# EasyEDA Pro project Type_C硬盘盒_2025-09-27_14-32-02.eprj, schematic Schematic1_1
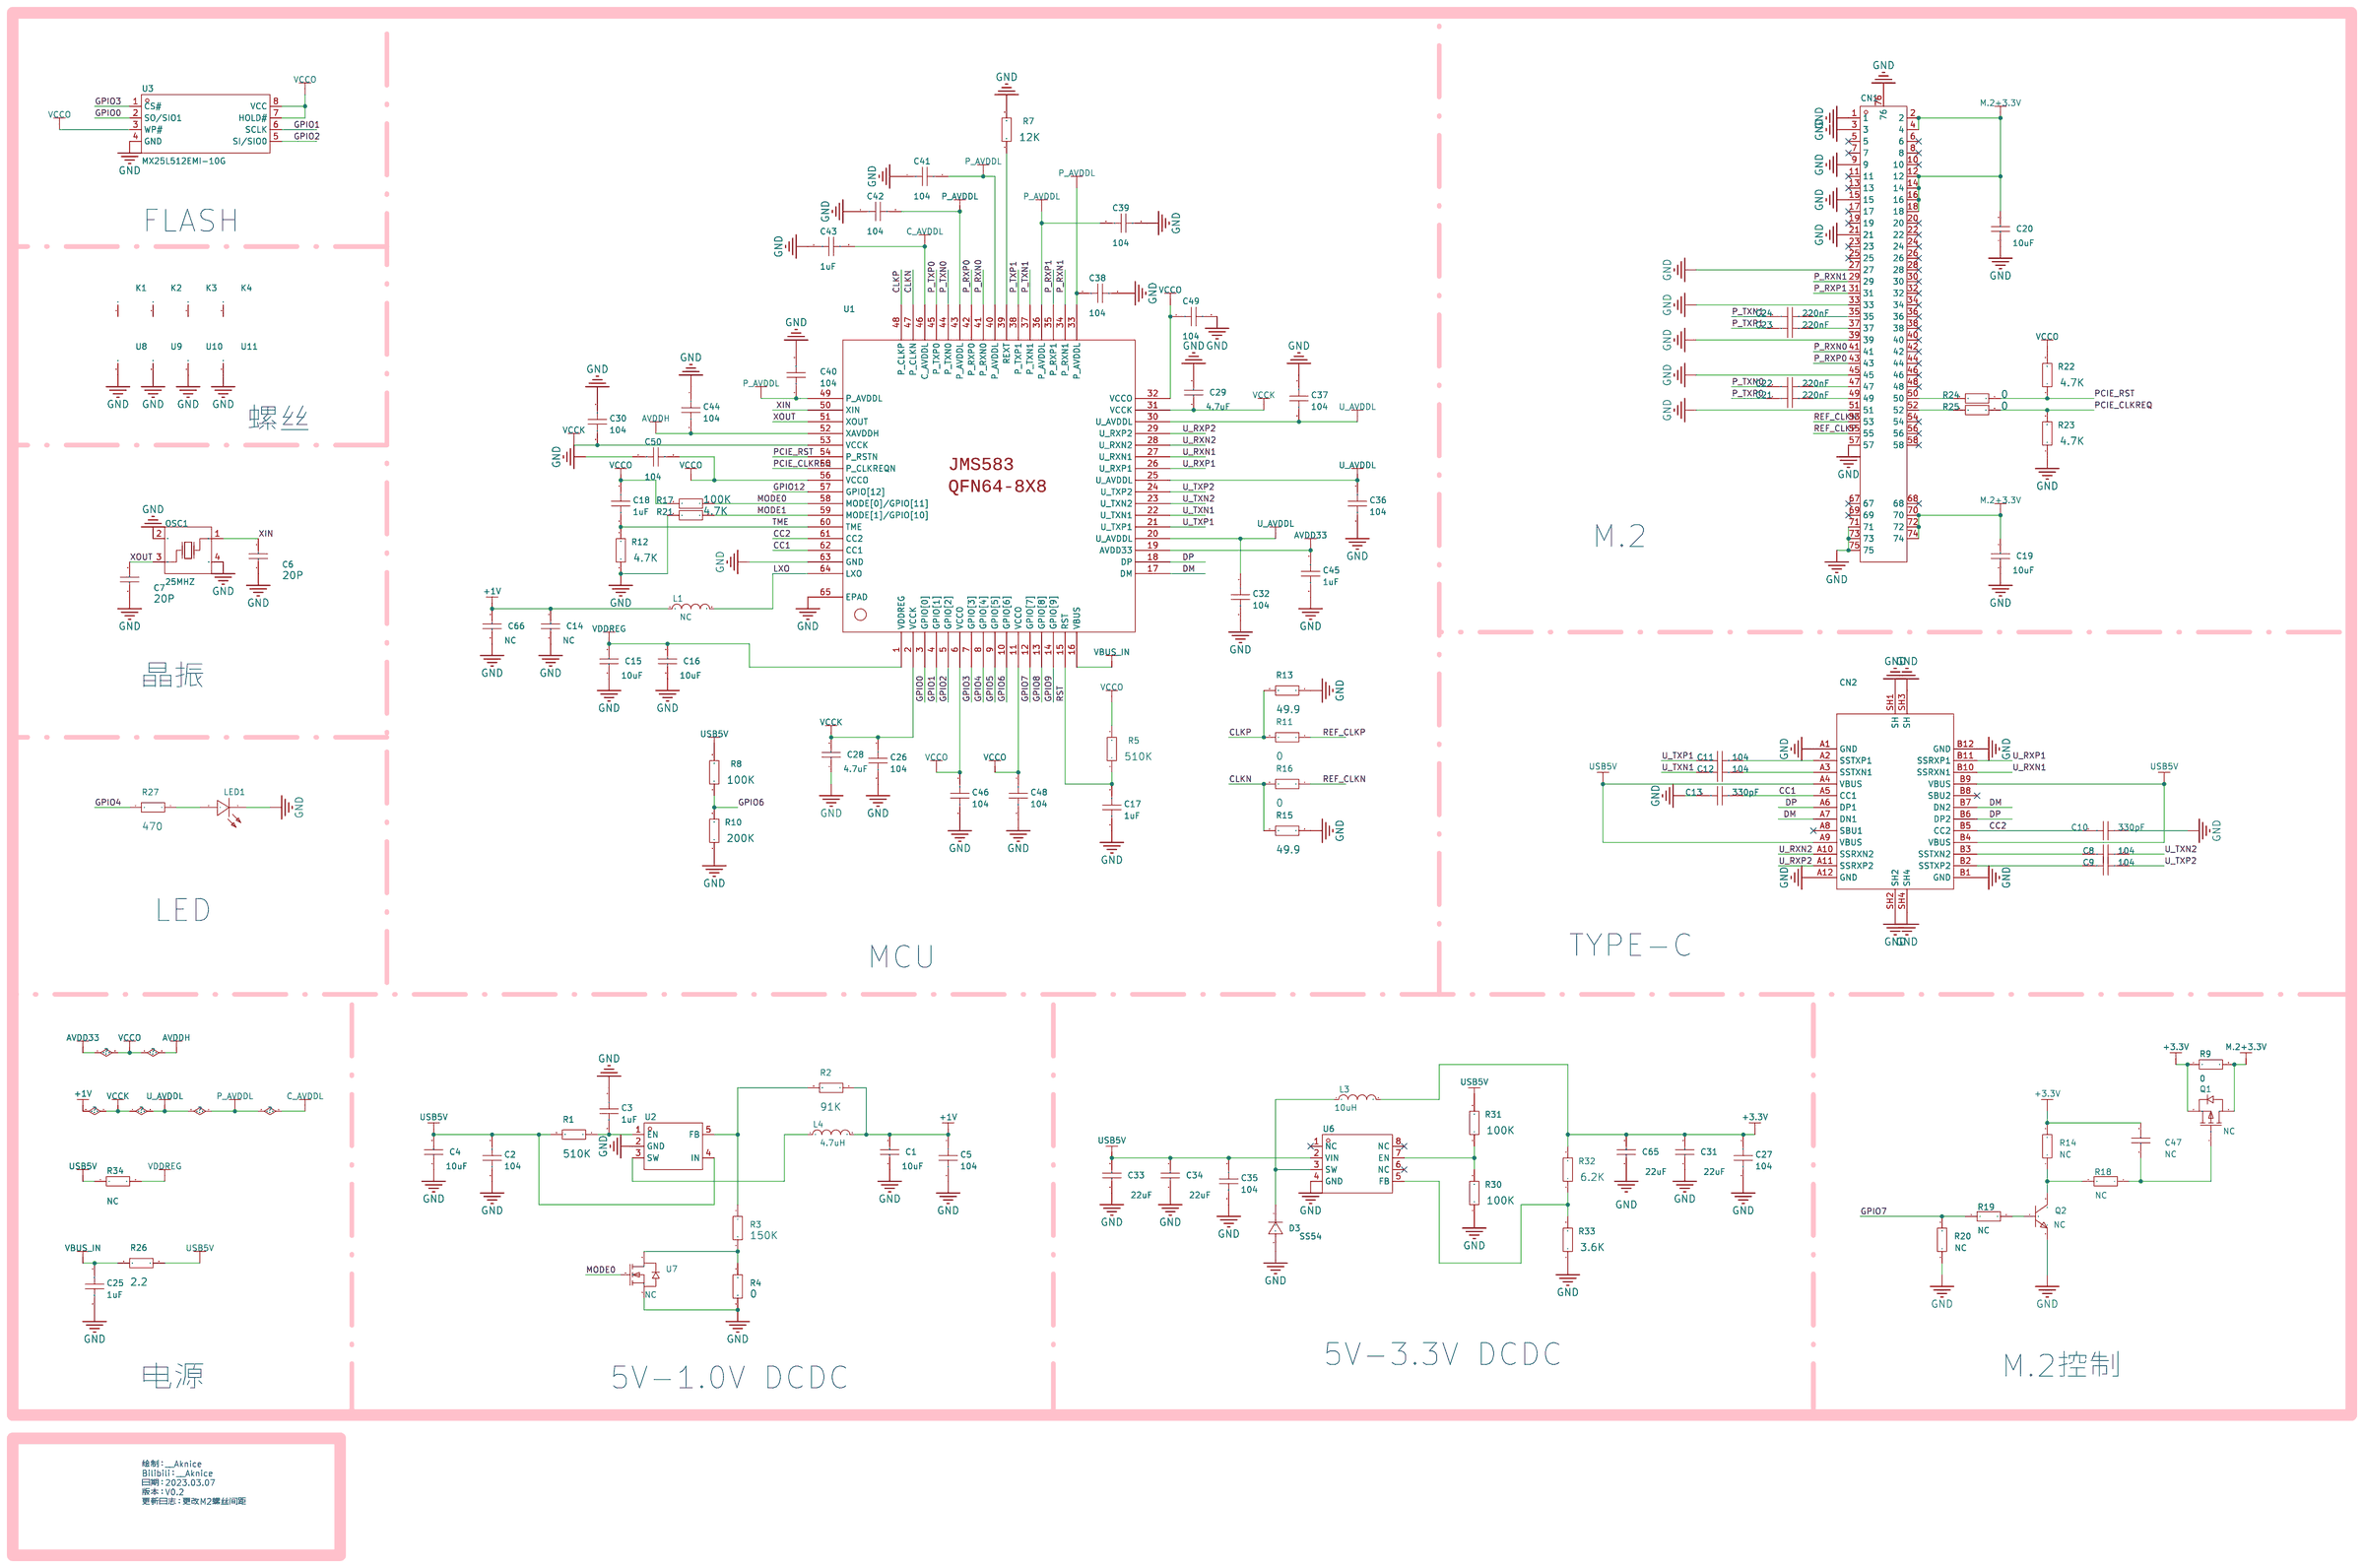
[diagram p1: schematic sheet]

## Parts
C1  100nF  [C0805]
C2  104  [C0603]
C3  1uF  [C0603]
C4  100nF  [C0805]
C5  104  [C0603]
C6  33pF  [C0603]
C7  33pF  [C0603]
C8  104  [C0603]
C9  104  [C0603]
C10  330pF  [C0603]
C11  104  [C0603]
C12  104  [C0603]
C13  330pF  [C0603]
C14  100nF  [C0805]
C15  100nF  [C0805]
C16  100nF  [C0805]
C17  1uF  [C0603]
C18  1uF  [C0603]
C19  100nF  [C0805]
C20  100nF  [C0805]
C21  220nF  [C0603]
C22  220nF  [C0603]
C23  220nF  [C0603]
C24  220nF  [C0603]
C25  1uF  [C0603]
C26  104  [C0603]
C27  104  [C0603]
C28  100nF  [C0805]
C29  100nF  [C0805]
C30  104  [C0603]
C31  100uF  [C1206]
C32  104  [C0603]
C33  100uF  [C1206]
C34  100uF  [C1206]
C35  104  [C0603]
C36  104  [C0603]
C37  104  [C0603]
C38  104  [C0603]
C39  104  [C0603]
C40  104  [C0603]
C41  104  [C0603]
C42  104  [C0603]
C43  1uF  [C0603]
C44  104  [C0603]
C45  1uF  [C0603]
C46  104  [C0603]
C47  NC  [C0805]
C48  104  [C0603]
C49  104  [C0603]
C50  104  [C0603]
C65  100uF  [C1206]
C66  100nF  [C0805]
CN1  91302-32-067RDM  [CONN-SMD_91302-32-067RDM]
CN2  USB-307HE-B-SU  [USB-TYPE-C-SMD_USB-307HE-B-SU]
D3  SS54  [SMA_L4.3-W2.7-LS5.1-RD]
K1  -  [M3无外边]
K2  -  [M3无外边]
K3  -  [M3无外边]
K4  -  [M3无外边]
L1  4.7uH  [IND-SMD_L4.5-W4.0-1]
L3  1uH  [IND-SMD_L7.3-W6.6]
L4  4.7uH  [IND-SMD_L4.5-W4.0-1]
LED1  led0805  [LED0805-RD]
OSC1  25MHZ  [OSC-SMD_4P-L3.2-W2.5-BL]
Q1  NC  [SOT-23-3_L2.9-W1.3-P1.90-LS2.4-BR]
Q2  NC  [SOT-23-3_L2.9-W1.3-P1.90-LS2.4-BR]
R1  510K  [R0603]
R2  510K  [R0603]
R3  510K  [R0603]
R4  510K  [R0603]
R5  510K  [R0603]
R7  510K  [R0603]
R8  510K  [R0603]
R9  0  [R1206]
R10  510K  [R0603]
R11  510K  [R0603]
R12  510K  [R0603]
R13  510K  [R0603]
R14  NC  [R0603]
R15  510K  [R0603]
R16  510K  [R0603]
R17  510K  [R0603]
R18  NC  [R0603]
R19  NC  [R0603]
R20  NC  [R0603]
R21  510K  [R0603]
R22  510K  [R0603]
R23  510K  [R0603]
R24  510K  [R0603]
R25  510K  [R0603]
R26  510K  [R0603]
R27  510K  [R0603]
R30  100K  [R0603]
R31  100K  [R0603]
R32  6.2K  [R0603]
R33  3.6K  [R0603]
R34  NC  [R1206]
U1  JMS583  [QFN-64_L8.0-W8.0-P0.40-TL-EP6.0]
U2  RY3430  [TSOT-23-5_L2.9-W1.6-P0.95-LS2.8-BR]
U3  MX25L512EMI-10G  [SOP-8_L4.9-W3.9-P1.27-LS6.0-BL]
U6  TD1583  [SOP-8_L5.0-W4.0-P1.27-LS6.0-BL]
U7  NC  [SOT-23-3_L2.9-W1.3-P0.95-LS2.4-BR]
U8  -  [M3]
U9  -  [M3]
U10  -  [M3]
U11  -  [M3]

## Library data of the parts
C1 C4 C14-C16 C19 C20 C28 C29 C47 C66 = CC0805KRX7R9BB104: 容值:100nF;精度:±10%;额定电压:50V;材质(温度系数):X7R;; LCSC Part Name: 100nF ±10% 50V; Supplier Part: C49678; Manufacturer: YAGEO(国巨); Supplier Footprint: 0805; JLCPCB Part Class: 基础库; Datasheet: https://atta.szlcsc.com/upload/public/pdf/source/20151026/1457707504898.pdf; Supplier: LCSC; Tolerance: ±10%; Voltage Rated: 50V; Temperature Coefficient: X7R
C2 C3 C5 C8-C13 C17 C18 C21-C27 C30 C32 C35-C46 C48-C50 = CC0603KRX7R8BB474: 精度:±10%;容值:470nF;额定电压:25V;温漂系数（介质材料):X7R;; LCSC Part Name: 470nF(474) ±10% 25V; Supplier Part: C106854; Supplier Footprint: 0603; JLCPCB Part Class: 扩展库; Datasheet: https://atta.szlcsc.com/upload/public/pdf/source/20190902/C106854_B621F3F82DC7FB7708A2F9CEE6ED7E21.pdf; Supplier: LCSC
C6 C7 = CC0603JRNPO9BN270: 容值:27pF;精度:±5%;额定电压:50V;材质(温度系数):NP0;; LCSC Part Name: 27pF ±5% 50V; Supplier Part: C107045; Manufacturer: YAGEO(国巨); Supplier Footprint: 0603; JLCPCB Part Class: 基础库; Datasheet: https://atta.szlcsc.com/upload/public/pdf/source/20170420/1492670692625.pdf; Supplier: LCSC; Tolerance: ±5%; Voltage Rated: 50V; Temperature Coefficient: NP0
C31 C33 C34 C65 = C1206-100u: 容值:100uF;精度:±20%;额定电压:6.3V;温度系数:X5R;; LCSC Part Name: 100uF ±20% 6.3V; Supplier Part: C15008; Manufacturer: SAMSUNG(三星); Manufacturer Part: CL31A107MQHNNNE; Supplier Footprint: 1206; JLCPCB Part Class: 基础库; Datasheet: https://atta.szlcsc.com/upload/public/pdf/source/20160103/1457707673200.pdf; Supplier: LCSC; Tolerance: ±20%; Voltage Rated: 6.3V; Temperature Coefficient: X5R
CN1 = 91302-32-067RDM: 连接器类型:M.2;间距:0.5mm;引脚总数:67;安装方式:卧贴;工作温度范围:-;; LCSC Part Name: M.2 0.5mm P数:67; Supplier Part: C1509730; Manufacturer: UMaxconn; Supplier Footprint: SMD,P=0.5mm; JLCPCB Part Class: 扩展库; Datasheet: https://atta.szlcsc.com/upload/public/pdf/source/20201222/C1509730_AC90C0C57A92915C4400196DE1999DDA.pdf; Supplier: LCSC; Connector Type: M.2; Pitch: 0.5mm; Number of Pins: 67; Mounting Style: 卧贴; Height Above Board: 3.2mm
CN2 = USB-307HE-B-SU: 连接器类型:Type-C;标准:-;公母:母座;触点数量:24;端口数量:1;安装方式:夹板;额定电流 - 电源:3A;工作温度范围:-;; LCSC Part Name: USB 3.1 C TYPE夹板式0.8 CONN.; Supplier Part: C309351; Manufacturer: HOOYA(香港皓宇); Datasheet: https://atta.szlcsc.com/upload/public/pdf/source/20181226/C309351_EE1D2376221C0442560ED3DEEBB52665.pdf; Supplier: LCSC; Connector Type: Type-C; Gender: 母座; Number of Contacts: 24; Number of Ports: 1; Mounting Style: 夹板; Current Rating - Power (Max): 3A
D3 = SS54_C908681: 二极管配置:独立式;直流反向耐压(Vr):40V;平均整流电流(Io):5A;正向压降(Vf):550mV@5A;反向电流(Ir):200uA@40V;; LCSC Part Name: 40V 5A 550mV@5A; Supplier Part: C908681; Manufacturer: GOODWORK(固得沃克); Supplier Footprint: SMA(DO-214AC); JLCPCB Part Class: 扩展库; Datasheet: https://atta.szlcsc.com/upload/public/pdf/source/20201231/C908681_158ABAA664540D50A678084047C4E457.pdf; Supplier: LCSC; Diode Configuration: 独立式; Reverse Voltage (Vr): 40V; Average Rectified Current (Io): 5A; Forward Voltage (Vf@If): 550mV@5A; Reverse Leakage Current (Ir): 200uA@40V
K1-K4 = M3无外边: Pin Type: IN
L1 L4 = MCS0420-4R7MPN2: 电感值:4.7uH;精度:±20%;额定电流:2.2A;饱和电流(Isat):3.5A;直流电阻(DCR):98mΩ;; LCSC Part Name: 4.7uH ±20% 2.2A 98mΩ; Supplier Part: C2937092; Manufacturer: PSA(信昌电陶); Supplier Footprint: 0420; JLCPCB Part Class: 扩展库; Datasheet: https://atta.szlcsc.com/upload/public/pdf/source/20220121/BD01ABADD177E465ADC6F87339B1CE90.pdf; Supplier: LCSC; Tolerance: ±20%; Rated Current: 2.2A; Saturation Current (Isat): 3.5A; DC Resistance (DCR): 98mΩ
L3 = MCS0630-1R0MPY1: 电感值:1uH;精度:±20%;额定电流:11A;饱和电流(Isat):20A;直流电阻(DCR):9mΩ;; LCSC Part Name: 1uH ±20% 11A 9mΩ; Supplier Part: C2937095; Manufacturer: PSA(信昌电陶); Supplier Footprint: 0630; JLCPCB Part Class: 扩展库; Datasheet: https://atta.szlcsc.com/upload/public/pdf/source/20220121/EA6E6E6F70ED7BAE67EC293805EAAACB.pdf; Supplier: LCSC; Tolerance: ±20%; Rated Current: 11A; Saturation Current (Isat): 20A; DC Resistance (DCR): 9mΩ
LED1 = led0805: Supplier Part: C9900012722; JLCPCB Part Class: 扩展库; Datasheet: https://atta.szlcsc.comnull; Supplier: LCSC
OSC1 = 贴片晶振3225: Supplier Part: C9900018144; Supplier Footprint: OSC-SMD-4P; JLCPCB Part Class: 扩展库; Datasheet: https://atta.szlcsc.comnull; Supplier: LCSC
Q1 = AO3401_C427383: 类型:-;漏源电压(Vdss):-;连续漏极电流(Id):-;功率(Pd):-;导通电阻(RDS(on)@Vgs,Id):-;阈值电压(Vgs(th)@Id):-;栅极电荷(Qg@Vgs):-;输入电容(Ciss@Vds):-;反向传输电容(Crss@Vds):-;; LCSC Part Name: AO3401; Supplier Part: C427383; Manufacturer: MDD; Supplier Footprint: SOT-23; JLCPCB Part Class: 扩展库; Datasheet: https://atta.szlcsc.com/upload/public/pdf/source/20200323/C427383_8CDBCA6C839881B350ABADB2BFB47866.pdf; Supplier: LCSC
Q2 = MMBT3904_C20526: 晶体管类型:NPN;集射极击穿电压(Vceo):40V;集电极电流(Ic):200mA;功率(Pd):200mW;集电极截止电流(Icbo):100nA;集电极-发射极饱和电压(VCE(sat)@Ic,Ib):300mV@50mA,5mA;直流电流增益(hFE@Ic,Vce):100@10mA,1V;特征频率(fT):300MHz;工作温度:+150℃@(Tj);; LCSC Part Name: NPN 40V 200mA; Supplier Part: C20526; Manufacturer: CJ(江苏长电/长晶); Supplier Footprint: SOT-23-3; JLCPCB Part Class: 基础库; Datasheet: https://atta.szlcsc.com/upload/public/pdf/source/20220704/70F575FB75061E03F919270A6BB8BA7F.pdf; Supplier: LCSC; Transistor Type: NPN; Collector-Emitter Breakdown Voltage (Vceo): 40V; Collector Current (Ic): 200mA; Power Dissipation (Pd): 200mW; Collector Cut-Off Current (Icbo): 100nA; Collector-Emitter Saturation Voltage (VCE(sat)@Ic,Ib): 300mV@50mA,5mA; DC Current Gain (hFE@Ic,Vce): 100@10mA,1V; Transition Frequency (fT): 300MHz; Operating Temperature: +150℃@(Tj)
R1-R5 R7 R8 R10-R13 R15-R17 R21-R27 R30-R33 = HPCR0603F1R60K9: 电阻类型:厚膜电阻;阻值:1.6Ω;精度:±1%;功率:200mW;温度系数:±100ppm/;最大工作电压:50V;工作温度范围:-55~+125;; LCSC Part Name: 1.6Ω ±1% 200mW; Supplier Part: C365113; Manufacturer: RESI(开步睿思）; Supplier Footprint: 0603; JLCPCB Part Class: 扩展库; Datasheet: https://atta.szlcsc.com/upload/public/pdf/source/20190129/C365113_A50EEECC514D260FF29A0C4387F8611D.pdf; Supplier: LCSC; Type: 厚膜电阻; Tolerance: ±1%; Power(Watts): 200mW; Temperature Coefficient: ±100ppm/; Overload Voltage (Max): 50V; Operating Temperature Range: -55~+125
R9 = 1206W4F0000T5E: 电阻类型:厚膜电阻;阻值:0Ω;精度:±1%;功率:250mW;温度系数:±800ppm/℃;最大工作电压:200V;工作温度范围:-55℃~+155℃;; LCSC Part Name: 0Ω ±1% 250mW; Supplier Part: C17888; Manufacturer: UNI-ROYAL(厚声); Supplier Footprint: 1206; Datasheet: https://atta.szlcsc.com/upload/public/pdf/source/20200306/C422600_1E6D84923E4A46A82E41ADD87F860B5C.pdf; Supplier: LCSC; Type: 厚膜电阻; Tolerance: ±1%; Power(Watts): 250mW; Temperature Coefficient: ±800ppm/℃; Overload Voltage (Max): 200V; Operating Temperature Range: -55℃~+155℃
R14 R18-R20 = 10K0.5%10PPM-0603: Supplier Part: C9900011732; JLCPCB Part Class: 扩展库; Datasheet: https://atta.szlcsc.comnull; Supplier: LCSC
R34 = AR06BTB9763: Supplier Part: C2916156; JLCPCB Part Class: 扩展库; Datasheet: 2021-11-04/33641G/08f7f16a7b534113bcfd2744f90b5ca7/精密电阻AR.pdf; Supplier: LCSC
U1 = JMS583: PCB Footprint: QFN64-8X8-1
U2 = RY3430: LCSC Part Name: RY3430 Buck, 2.5-5.5V, 3A, 1.2MHz, VFB 0.6V, SOT23-5; Supplier Part: C370755; Manufacturer: RYCHiP(蕊源); Supplier Footprint: SOT23-5; JLCPCB Part Class: 扩展库; Datasheet: https://atta.szlcsc.com/upload/public/pdf/source/20190329/C370755_D1D758FBB64C4094BC8849CA0E75622A.pdf; Supplier: LCSC
U3 = MX25L512EMI-10G: 存储器类型:-;存储器构架(格式):-;技术:-;存储器容量:-;时钟频率:-;存储器接口类型:-;; Supplier Part: C504710; Manufacturer: MXIC(旺宏电子); Supplier Footprint: SOP-8; JLCPCB Part Class: 扩展库; Datasheet: https://atta.szlcsc.com/upload/public/pdf/source/20200331/C504710_5ED5CB8CE5B114FB682A35BA2581B2D0.pdf; Supplier: LCSC
U6 = TD1583_C193227: 功能类型:降压型;同步整流:否;输出通道数:1;拓扑结构:降压式;输入电压:3.6V~28V;输出电压:1.222V~26V;输出电流(最大值):3A;开关频率:380kHz;; LCSC Part Name: 降压型 Vin=3.6V~28V Vout=1.222V~26V 3A; Supplier Part: C193227; Manufacturer: Techcode(泰德); Supplier Footprint: SOP-8-4.0mm; JLCPCB Part Class: 扩展库; Datasheet: https://atta.szlcsc.com/upload/public/pdf/source/20180528/C193227_717CB2756CFDF287E4879B380B2F546B.pdf; Supplier: LCSC; Function: 降压型; Synchronous Rectification: 否; Number of Outputs: 1; Topology: 降压式; Input Voltage: 3.6V~28V; Output Voltage: 1.222V~26V; Output Current (Max): 3A; Switching Frequency: 380kHz
U7 = NMOS3400: Supplier Part: C9900021947; Supplier Footprint: SOT-23; JLCPCB Part Class: 扩展库; Datasheet: https://atta.szlcsc.comnull; Supplier: LCSC
U8-U11 = M3: Pin Type: IN

## Nets
+1V: C1.2 C5.1 C14.2 C26.1 C28.2 C29.1 C30.2 C32.1 C36.1 C37.2 C38.1 C39.1 C40.1 C41.2 C42.2 C43.2 C66.2 L1.1 L4.2 R2.1 U1.2(VCCK) U1.20(U_AVDDL) U1.25(U_AVDDL) U1.30(U_AVDDL) U1.31(VCCK) U1.33(P_AVDDL) U1.36(P_AVDDL) U1.40(P_AVDDL) U1.43(P_AVDDL) U1.46(C_AVDDL) U1.49(P_AVDDL) U1.53(VCCK)
+3.3V: C27.1 C31.2 C47.2 C65.2 L3.2 Q1.2(S) R9.1 R14.2 R32.2
AVDD33: C18.1 C44.2 C45.1 C46.1 C48.1 C49.1 C50.2 R5.2 R17.2 R22.2 U1.6(VCCO) U1.11(VCCO) U1.19(AVDD33) U1.32(VCCO) U1.52(XAVDDH) U1.56(VCCO) U3.3(WP#) U3.7(HOLD#) U3.8(VCC)
GND: C1.1 C2.2 C3.1 C4.1 C5.2 C6.1 C7.1 C10.1 C13.2 C14.1 C15.1 C16.1 C17.2 C19.1 C20.1 C25.2 C26.2 C27.2 C28.1 C29.2 C30.1 C31.1 C32.2 C33.1 C34.1 C35.2 C36.2 C37.1 C38.2 C39.2 C40.2 C41.1 C42.1 C43.1 C44.1 C45.2 C46.2 C48.2 C49.2 C50.1 C65.1 C66.1 CN1.1 CN1.3 CN1.9 CN1.15 CN1.21 CN1.27 CN1.33 CN1.39 CN1.45 CN1.51 CN1.57 CN1.71 CN1.73 CN1.75 CN1.76 CN2.A1(GND) CN2.A12(GND) CN2.B1(GND) CN2.B12(GND) CN2.SH1(SH) CN2.SH2 CN2.SH3(SH) CN2.SH4 D3.2 LED1.1(-) OSC1.2(NC) OSC1.4(NC) Q2.2(E) R4.2 R7.2 R10.1 R12.1 R13.1 R15.1 R20.1 R21.2 R23.1 R30.1 R33.1 U1.63(GND) U1.65(EPAD) U2.2(GND) U3.4(GND) U6.4(GND) U7.2(S) U8.1 U9.1 U10.1 U11.1
VBUS_IN: C25.1 R26.2 U1.16(VBUS)
VDDREG: C15.2 C16.2 R34.2 U1.1(VDDREG)
CC1: C13.1 CN2.A5(CC1) U1.62(CC1)
CC2: C10.2 CN2.B5(CC2) U1.61(CC2)
CLKN: R15.2 R16.2 U1.47(P_CLKN)
CLKP: R11.2 R13.2 U1.48(P_CLKP)
DM: CN2.A7(DN1) CN2.B7(DN2) U1.17(DM)
DP: CN2.A6(DP1) CN2.B6(DP2) U1.18(DP)
GPIO0: U1.3(GPIO[0]) U3.2(SO/SIO1)
GPIO1: U1.4(GPIO[1]) U3.6(SCLK)
GPIO2: U1.5(GPIO[2]) U3.5(SI/SIO0)
GPIO3: U1.7(GPIO[3]) U3.1(CS#)
GPIO4: R27.2 U1.8(GPIO[4])
GPIO5: U1.9(GPIO[5])
GPIO6: R8.1 R10.2 U1.10(GPIO[6])
GPIO7: R19.1 R20.2 U1.12(GPIO[7])
GPIO8: U1.13(GPIO[8])
GPIO9: U1.14(GPIO[9])
GPIO12: U1.57(GPIO[12])
LXO: L1.2 U1.64(LXO)
M.2+3.3V: C19.2 C20.2 CN1.2 CN1.4 CN1.12 CN1.14 CN1.16 CN1.18 CN1.70 CN1.72 CN1.74 Q1.3(D) R9.2
MODE0: R17.1 U1.58(MODE[0]/GPIO[11]) U7.1(G)
MODE1: R21.1 U1.59(MODE[1]/GPIO[10])
P_RXN0: CN1.41 U1.41(P_RXN0)
P_RXN1: CN1.29 U1.34(P_RXN1)
P_RXP0: CN1.43 U1.42(P_RXP0)
P_RXP1: CN1.31 U1.35(P_RXP1)
P_TXN0: C22.1 U1.44(P_TXN0)
P_TXN1: C24.1 U1.37(P_TXN1)
P_TXP0: C21.1 U1.45(P_TXP0)
P_TXP1: C23.1 U1.38(P_TXP1)
PCIE_CLKREQ: R23.2 R25.1 U1.55(P_CLKREQN)
PCIE_RST: R22.1 R24.1 U1.54(P_RSTN)
REF_CLKN: CN1.53 R16.1
REF_CLKP: CN1.55 R11.1
RST: C17.1 R5.1 U1.15(RST)
TME: C18.2 R12.2 U1.60(TME)
U_RXN1: CN2.B10(SSRXN1) U1.27(U_RXN1)
U_RXN2: CN2.A10(SSRXN2) U1.28(U_RXN2)
U_RXP1: CN2.B11(SSRXP1) U1.26(U_RXP1)
U_RXP2: CN2.A11(SSRXP2) U1.29(U_RXP2)
U_TXN1: C12.1 U1.22(U_TXN1)
U_TXN2: C8.2 U1.23(U_TXN2)
U_TXP1: C11.1 U1.21(U_TXP1)
U_TXP2: C9.2 U1.24(U_TXP2)
USB5V: C2.1 C4.2 C33.2 C34.2 C35.1 CN2.A4(VBUS) CN2.A9(VBUS) CN2.B4(VBUS) CN2.B9(VBUS) R1.2 R8.2 R26.1 R31.2 R34.1 U2.4(IN) U6.2(VIN)
XIN: C6.2 OSC1.1(OSC1) U1.50(XIN)
XOUT: C7.2 OSC1.3(OSC2) U1.51(XOUT)
$1N4205: D3.1 L3.1 U6.3(SW)
$1N4207: R30.2 R31.1 U6.7(EN)
$1N4210: R32.1 R33.2 U6.5(FB)
$1N5721: L4.1 U2.3(SW)
$1N6130: R3.2 R4.1 U7.3(D)
$1N6159: R2.2 R3.1 U2.5(FB)
$1N7264: Q2.3(C) R14.1 R18.2
$1N7265: C47.1 Q1.1(G) R18.1
$1N7717: Q2.1(B) R19.2
$1N13574: C8.1 CN2.B3(SSTXN2)
$1N13608: C9.1 CN2.B2(SSTXP2)
$1N14258: C11.2 CN2.A2(SSTXP1)
$1N14292: C12.2 CN2.A3(SSTXN1)
$1N19815: R7.1 U1.39(REXT)
$1N26384: CN1.50 R24.2
$1N26518: CN1.52 R25.2
$1N30420: C22.2 CN1.47
$1N30478: C21.2 CN1.49
$1N31117: C24.2 CN1.35
$1N31175: C23.2 CN1.37
$1N48921: LED1.2(+) R27.1
$1N58384: C3.2 R1.1 U2.1(EN)

Not connected (* = marked no-connect by the designer): CN1 5* 6* 7* 8* 10* 11* 13* 17* 19* 20* 22* 23* 24* 25* 26* 28* 30* 32* 34* 36* 38* 40* 42* 44* 46* 48* 54* 56* 58* 67* 68* 69*; CN2 A8(SBU1)* B8(SBU2)*; K1 1; K2 1; K3 1; K4 1; U6 1(NC)* 6(NC)* 8(NC)*

## Notes on the sheet
- FLASH
- 螺丝
- M.2
- 晶振
- LED
- TYPE-C
- MCU
- 5V-3.3V DCDC
- M.2控制
- 电源
- 5V-1.0V DCDC
- 绘制：__Aknice
  Bilibili：__Aknice
  日期：2023.03.07
  版本：V0.2
  更新日志：更改M2螺丝间距
